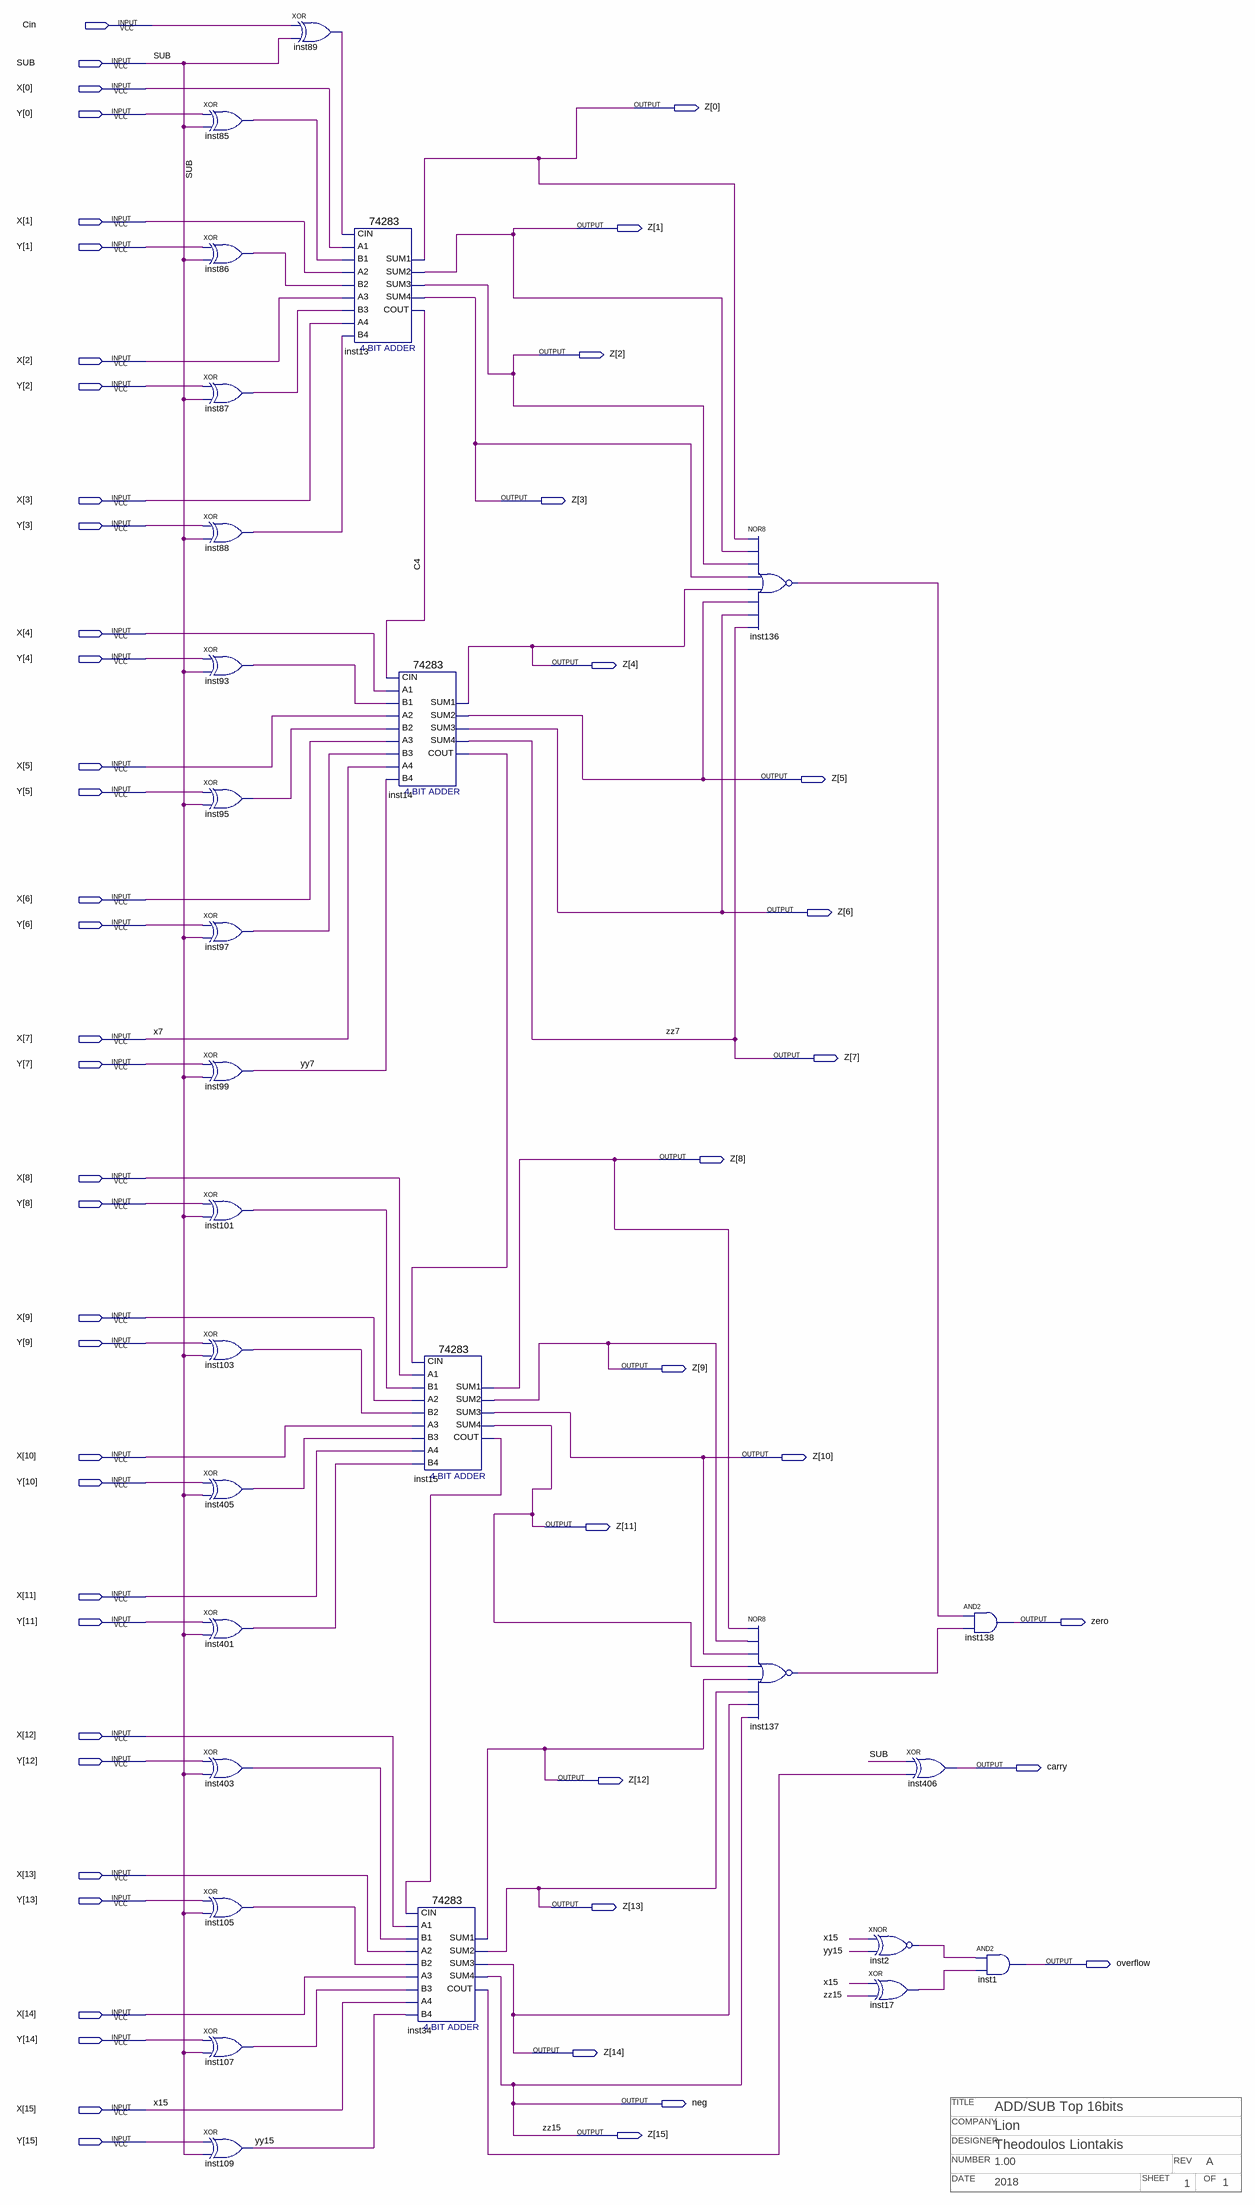
[diagram p0: schematic sheet]
// Quartus schematic ALU_LA4_32.bdf as structural Verilog: 28 symbols, 54 pins
// Title block: COMPANY: Lion; DATE: 2018; DESIGNER: Theodoulos Liontakis; NUMBER: 1.00; OF: 1; REV: A; SHEET: 1; TITLE: ADD/SUB Top 16bits
module ALU_LA4_32 (
  input  Cin,
  input  SUB,
  input  [15:0] X,
  input  [15:0] Y,
  output [15:0] Z,
  output zero,
  output carry,
  output overflow,
  output neg
);

  wire C4, inst2_out, inst14_cout, inst15_cout, inst17_out, inst34_cout, inst85_out, inst86_out, inst87_out,
       inst88_out, inst89_out, inst93_out, inst95_out, inst97_out, inst101_out, inst103_out, inst105_out,
       inst107_out, inst136_out, inst137_out, inst401_out, inst403_out, inst405_out, yy7, yy15;

  xor inst85 (inst85_out, Y[0], SUB);
  xor inst86 (inst86_out, Y[1], SUB);
  xor inst87 (inst87_out, Y[2], SUB);
  xor inst88 (inst88_out, Y[3], SUB);
  xor inst93 (inst93_out, Y[4], SUB);
  xor inst95 (inst95_out, Y[5], SUB);
  xor inst97 (inst97_out, Y[6], SUB);
  xor inst99 (yy7, Y[7], SUB);
  xor inst101 (inst101_out, Y[8], SUB);
  xor inst103 (inst103_out, Y[9], SUB);
  xor inst405 (inst405_out, Y[10], SUB);
  xor inst401 (inst401_out, Y[11], SUB);
  xor inst403 (inst403_out, Y[12], SUB);
  xor inst105 (inst105_out, Y[13], SUB);
  xor inst107 (inst107_out, Y[14], SUB);
  xor inst109 (yy15, Y[15], SUB);
  xor inst89 (inst89_out, Cin, SUB);
  \74283  inst13 (
    .CIN(inst89_out), .A1(X[0]), .A2(X[1]), .B2(inst86_out), .A3(X[2]), .A4(X[3]), .B4(inst88_out),
    .B1(inst85_out), .B3(inst87_out), .SUM4(Z[3]), .COUT(C4), .SUM1(Z[0]), .SUM2(Z[1]), .SUM3(Z[2]));
  \74283  inst14 (
    .CIN(C4), .A1(X[4]), .A2(X[5]), .B2(inst95_out), .A3(X[6]), .A4(X[7]), .B4(yy7), .B1(inst93_out),
    .B3(inst97_out), .SUM4(Z[7]), .COUT(inst14_cout), .SUM1(Z[4]), .SUM2(Z[5]), .SUM3(Z[6]));
  \74283  inst15 (
    .CIN(inst14_cout), .A1(X[8]), .A2(X[9]), .B2(inst103_out), .A3(X[10]), .A4(X[11]), .B4(inst401_out),
    .B1(inst101_out), .B3(inst405_out), .SUM4(Z[11]), .COUT(inst15_cout), .SUM1(Z[8]), .SUM2(Z[9]),
    .SUM3(Z[10]));
  \74283  inst34 (
    .CIN(inst15_cout), .A1(X[12]), .A2(X[13]), .B2(inst105_out), .A3(X[14]), .A4(X[15]), .B4(yy15),
    .B1(inst403_out), .B3(inst107_out), .SUM4(neg), .COUT(inst34_cout), .SUM1(Z[12]), .SUM2(Z[13]),
    .SUM3(Z[14]));
  nor inst136 (inst136_out, Z[0], Z[1], Z[2], Z[3], Z[4], Z[5], Z[6], Z[7]);
  nor inst137 (inst137_out, Z[8], Z[9], Z[10], Z[11], Z[12], Z[13], Z[14], neg);
  xnor inst2 (inst2_out, X[15], yy15);
  xor inst17 (inst17_out, X[15], neg);
  xor inst406 (carry, SUB, inst34_cout);
  and inst138 (zero, inst136_out, inst137_out);
  and inst1 (overflow, inst2_out, inst17_out);

  assign Z[15] = neg;

  // Other names for the same wires on the sheet: zz15 = neg; zz7 = Z[7]
endmodule
